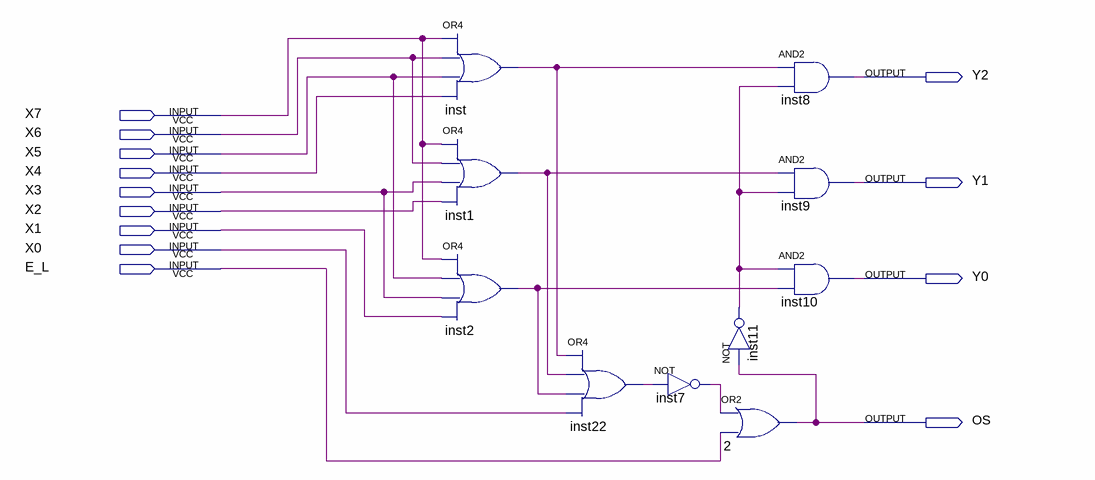
[diagram p0: schematic sheet]
// Quartus schematic PEnc8_3.bdf as structural Verilog: 10 symbols, 13 pins
module PEnc8_3 (
  input  X7,
  input  X6,
  input  X5,
  input  X4,
  input  X3,
  input  X2,
  input  X1,
  input  X0,
  input  E_L,
  output Y2,
  output Y1,
  output Y0,
  output OS
);

  wire inst1_out, inst2_out, inst7_out, inst11_out, inst22_out, inst_out;

  or inst (inst_out, X7, X6, X5, X4);
  or inst1 (inst1_out, X7, X6, X3, X2);
  or inst2 (inst2_out, X7, X5, X3, X1);
  or inst22 (inst22_out, inst_out, inst1_out, inst2_out, X0);
  not inst11 (inst11_out, OS);
  not inst7 (inst7_out, inst22_out);
  or u_2 (OS, inst7_out, E_L);
  and inst8 (Y2, inst_out, inst11_out);
  and inst9 (Y1, inst1_out, inst11_out);
  and inst10 (Y0, inst11_out, inst2_out);
endmodule
